# EAGLE design RAMPS-1-4-TMC (EAGLE 8.7.0)
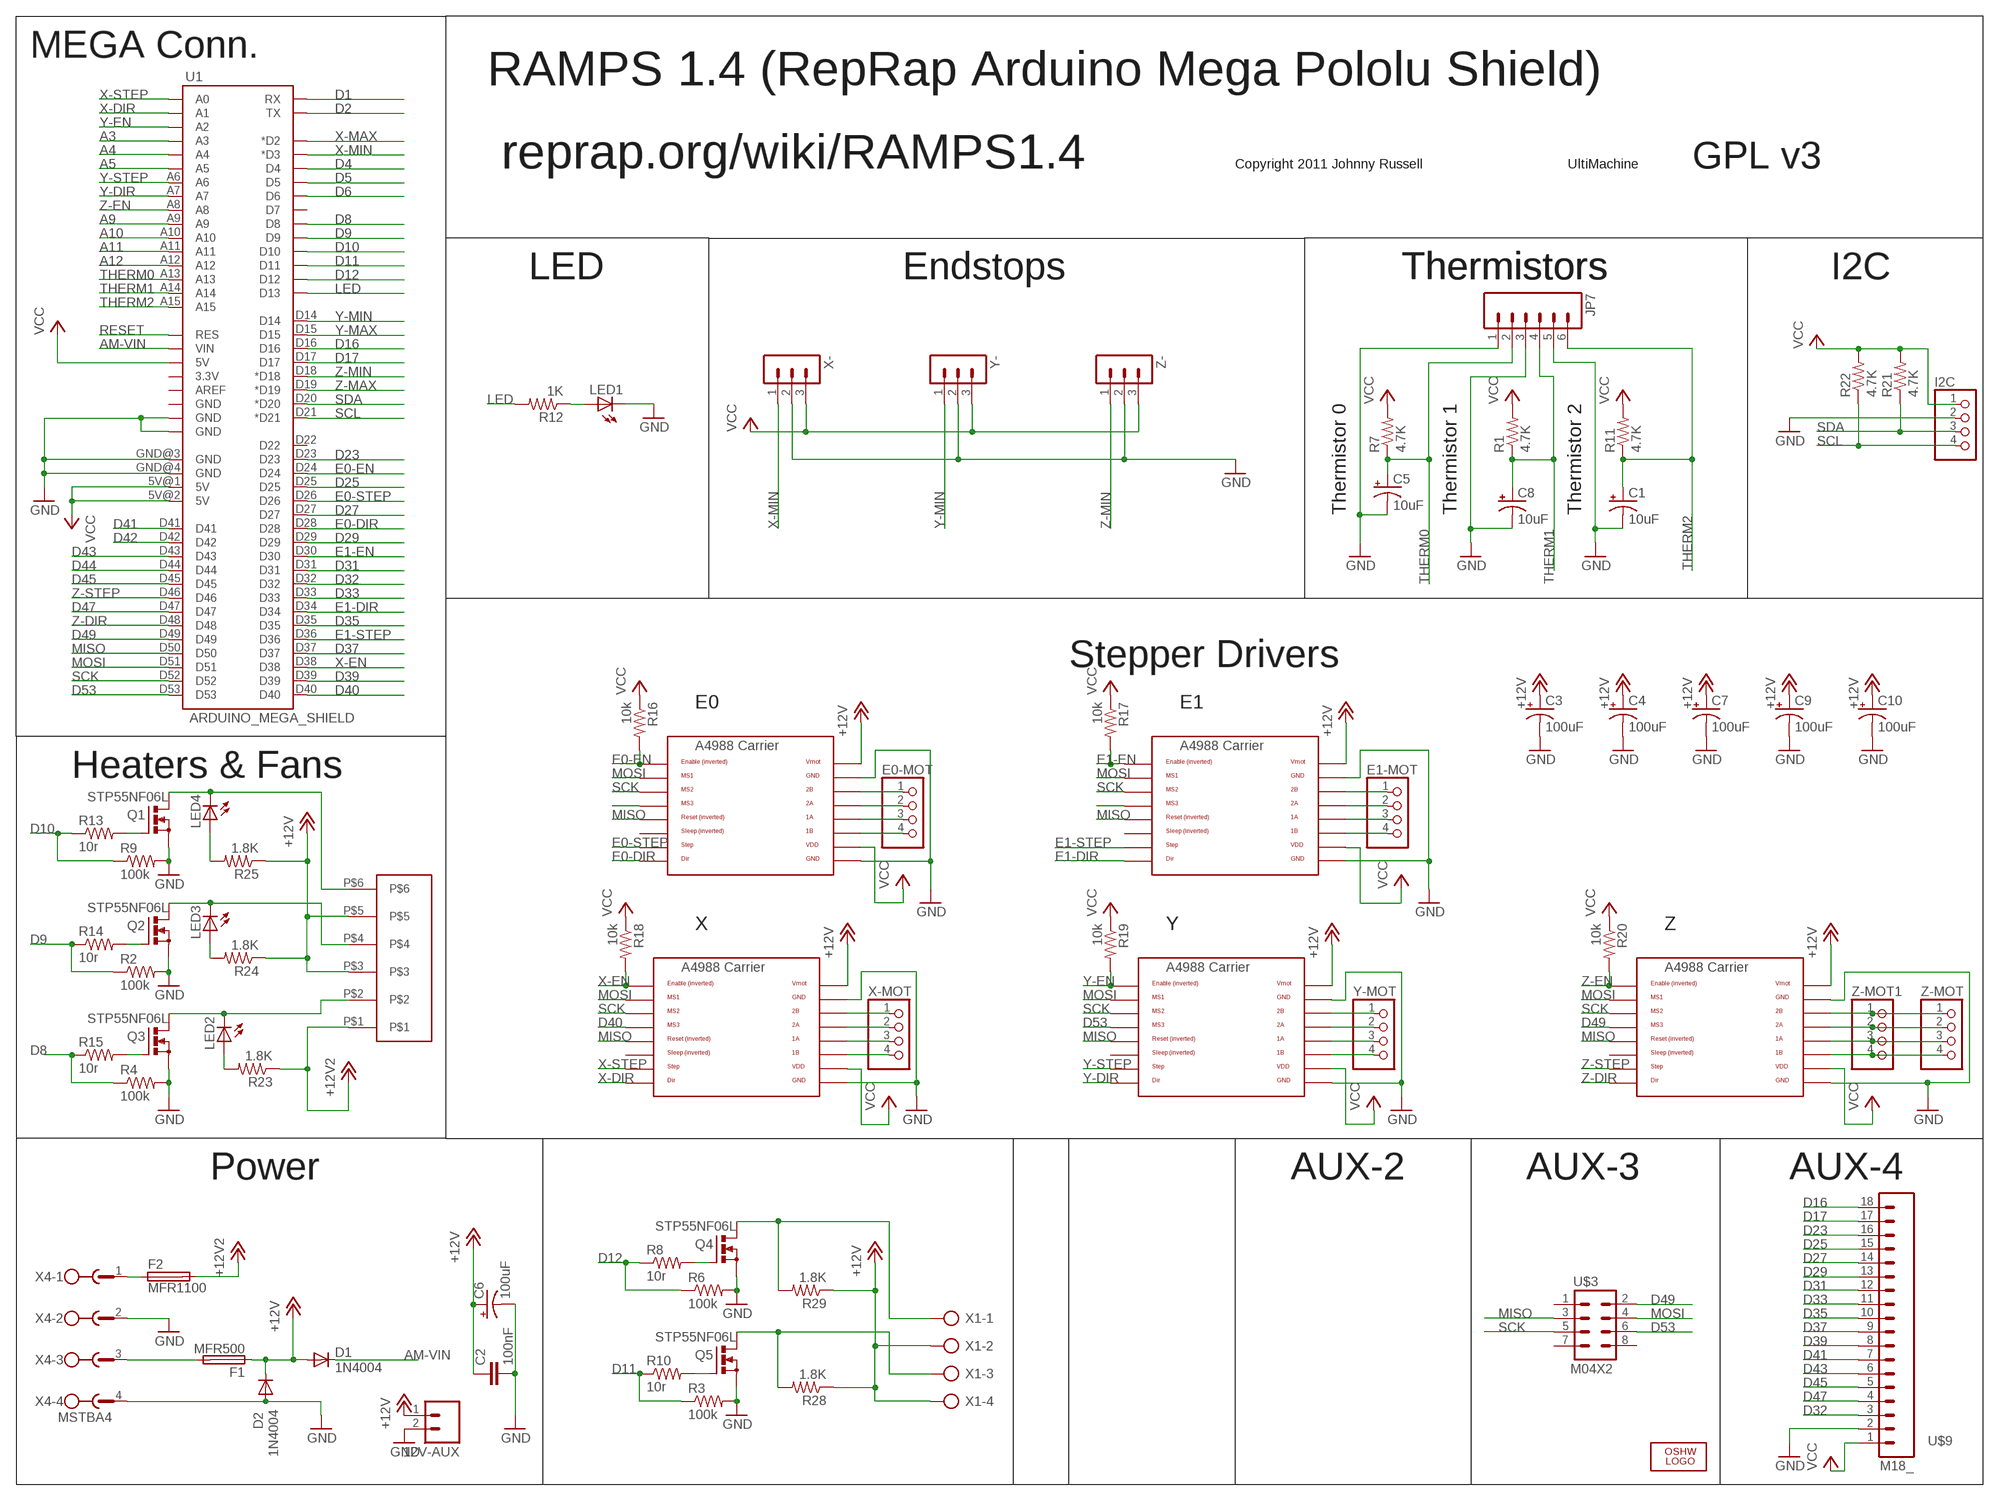
[diagram p0: schematic, sheet 1]

## Parts
12V-AUX  M02PTH  [1X02]
C1  10uF  CPOL-US153CLV-0405  [153CLV-0405]
C2  100nF  C-EUC0805  [C0805]
C3  100uF  CPOL-US153CLV-0605  [153CLV-0605]
C4  100uF  CPOL-US153CLV-0605  [153CLV-0605]
C5  10uF  CPOL-US153CLV-0405  [153CLV-0405]
C6  100uF  CPOL-US153CLV-0605  [153CLV-0605]
C7  100uF  CPOL-US153CLV-0605  [153CLV-0605]
C8  10uF  CPOL-US153CLV-0405  [153CLV-0405]
C9  100uF  CPOL-US153CLV-0605  [153CLV-0605]
C10  100uF  CPOL-US153CLV-0605  [153CLV-0605]
D1  1N4004  [DO41-10]
D2  1N4004  [DO41-10]
E0-MOT  PINHD-1X4  [1X04]
E1-MOT  PINHD-1X4  [1X04]
F1  MFR500  PTCFUSE  [MFR500]
F2  MFR1100  PTCFUSEMFR1100  [MFR1100]
I2C  PINHD-1X4  [1X04]
JP7  M06SIP  [1X06]
LED1  LEDCHIP-LED0805  [CHIP-LED0805]
LED2  LEDCHIP-LED0805  [CHIP-LED0805]
LED3  LEDCHIP-LED0805  [CHIP-LED0805]
LED4  LEDCHIP-LED0805  [CHIP-LED0805]
LOGO1  OSHW_LOGO_6MILX0100-NT  [OSHW_6X100_NOTEXT]
Q1  STP55NF06L  IRF512  [TO220BV]
Q2  STP55NF06L  IRF512  [TO220BV]
Q3  STP55NF06L  IRF512  [TO220BV]
Q4  STP55NF06L  IRF512  [TO220BV]
Q5  STP55NF06L  IRF512  [TO220BV]
R1  4.7K  R-US_R0805  [R0805]
R2  100k  R-US_R0805  [R0805]
R3  100k  R-US_R0805  [R0805]
R4  100k  R-US_R0805  [R0805]
R6  100k  R-US_R0805  [R0805]
R7  4.7K  R-US_R0805  [R0805]
R8  10r  R-US_R0805  [R0805]
R9  100k  R-US_R0805  [R0805]
R10  10r  R-US_M0805  [M0805]
R11  4.7K  R-US_R0805  [R0805]
R12  1K  R-US_R0805  [R0805]
R13  10r  R-US_R0805  [R0805]
R14  10r  R-US_M0805  [M0805]
R15  10r  R-US_R0805  [R0805]
R16  10k  R-US_R0805  [R0805]
R17  10k  R-US_R0805  [R0805]
R18  10k  R-US_R0805  [R0805]
R19  10k  R-US_R0805  [R0805]
R20  10k  R-US_R0805  [R0805]
R21  4.7K  R-US_R0805  [R0805]
R22  4.7K  R-US_R0805  [R0805]
R23  1.8K  R-US_R0805  [R0805]
R24  1.8K  R-US_R0805  [R0805]
R25  1.8K  R-US_R0805  [R0805]
R28  1.8K  R-US_R0805  [R0805]
R29  1.8K  R-US_R0805  [R0805]
U1  ARDUINO_MEGA_SHIELD  [ARDUINO_MEGA_SHIELD]
U$2  282837-6  [282837-6]
U$3  M04X2  [2X4]
U$4  A4988BREAKOUT  [A4988BREAKOUT]
U$5  A4988BREAKOUT  [A4988BREAKOUT]
U$6  A4988BREAKOUT  [A4988BREAKOUT]
U$7  A4988BREAKOUT  [A4988BREAKOUT]
U$8  A4988BREAKOUT  [A4988BREAKOUT]
U$9  M18_  [1X18]
X1  AK500/4  [AK500/4]
X4  MSTBA4  [MSTBA4]
X-  3PIN-HEADER  [3PIN-HEADER]
X-MOT  PINHD-1X4  [1X04]
Y-  3PIN-HEADER  [3PIN-HEADER]
Y-MOT  PINHD-1X4  [1X04]
Z-  3PIN-HEADER  [3PIN-HEADER]
Z-MOT  PINHD-1X4  [1X04]
Z-MOT1  PINHD-1X4  [1X04]

## Nets
+12V: 12V-AUX.1 C2.1 C3.+ C4.+ C6.+ C7.+ C9.+ C10.+ D1.A D2.C F1.1 R24.1 R25.1 R28.1 R29.1 U$2.P$3 U$2.P$5 U$4.VMOT U$5.VMOT U$6.VMOT U$7.VMOT U$8.VMOT X1.2 X1.4
+12V2: F2.2 R23.1 U$2.P$1
A3: U1.A3
A4: U1.A4
A5: U1.A5
A9: U1.A9
A10: U1.A10
A11: U1.A11
A12: U1.A12
AM-VIN: D1.C U1.VIN
D1: U1.RX
D2: U1.TX
D4: U1.D4
D5: U1.D5
D6: U1.D6
D8: R4.1 R15.1 U1.D8
D9: R2.1 R14.1 U1.D9
D10: R9.1 R13.1 U1.D10
D11: R3.1 R10.1 U1.D11
D12: R6.1 R8.1 U1.D12
D16: U1.D16 U$9.18
D17: U1.D17 U$9.17
D23: U1.D23 U$9.16
D25: U1.D25 U$9.15
D27: U1.D27 U$9.14
D29: U1.D29 U$9.13
D31: U1.D31 U$9.12
D32: U1.D32 U$9.3
D33: U1.D33 U$9.11
D35: U1.D35 U$9.10
D37: U1.D37 U$9.9
D39: U1.D39 U$9.8
D40: U1.D40 U$6.MS3
D41: U1.D41 U$9.7
D42: U1.D42
D43: U1.D43 U$9.6
D44: U1.D44
D45: U1.D45 U$9.5
D47: U1.D47 U$9.4
D49: U1.D49 U$3.2 U$8.MS3
D53: U1.D53 U$3.6 U$7.MS3
E0-DIR: U1.D28 U$4.DIR
E0-EN: R16.2 U1.D24 U$4.EN
E0-STEP: U1.D26 U$4.STEP
E1-DIR: U1.D34 U$5.DIR
E1-EN: R17.2 U1.D30 U$5.EN
E1-STEP: U1.D36 U$5.STEP
GND: 12V-AUX.2 C1.- C2.2 C3.- C4.- C5.- C6.- C7.- C8.- C9.- C10.- D2.A I2C.2 JP7.1 JP7.3 JP7.5 LED1.C Q1.S Q2.S Q3.S Q4.S Q5.S R2.2 R3.2 R4.2 R6.2 R9.2 U1.GND@0(GND) U1.GND@1(GND) U1.GND@3(GND) U1.GND@4(GND) U$4.GND U$4.GND@0(GND) U$5.GND U$5.GND@0(GND) U$6.GND U$6.GND@0(GND) U$7.GND U$7.GND@0(GND) U$8.GND U$8.GND@0(GND) U$9.2 X4.2 X4.4 X-.2 Y-.2 Z-.2
LED: R12.2 U1.D13
MISO: U1.D50 U$3.3 U$4.RST U$5.RST U$6.RST U$7.RST U$8.RST
MOSI: U1.D51 U$3.4 U$4.MS1 U$5.MS1 U$6.MS1 U$7.MS1 U$8.MS1
N$1: LED3.C Q2.D U$2.P$4
N$3: E0-MOT.1 U$4.2B
N$4: E0-MOT.2 U$4.2A
N$6: U$4.MS3
N$7: LED4.C Q1.D U$2.P$6
N$8: Q4.D R29.2 X1.1
N$9: Q5.G R10.2
N$10: E0-MOT.3 U$4.1A
N$11: E0-MOT.4 U$4.1B
N$12: E1-MOT.1 U$5.2B
N$13: E1-MOT.2 U$5.2A
N$14: Q4.G R8.2
N$15: U$5.MS3
N$16: E1-MOT.3 U$5.1A
N$18: E1-MOT.4 U$5.1B
N$20: Q5.D R28.2 X1.3
N$21: U$6.2B X-MOT.1
N$22: U$6.2A X-MOT.2
N$26: U$6.1A X-MOT.3
N$27: U$6.1B X-MOT.4
N$28: U$7.2B Y-MOT.1
N$29: U$7.2A Y-MOT.2
N$30: U$7.1A Y-MOT.3
N$32: LED2.A R23.2
N$36: U$7.1B Y-MOT.4
N$41: U$8.2B Z-MOT1.1 Z-MOT.1
N$42: U$8.2A Z-MOT1.2 Z-MOT.2
N$43: U$8.1A Z-MOT1.3 Z-MOT.3
N$44: U$8.1B Z-MOT1.4 Z-MOT.4
N$45: LED3.A R24.2
N$46: LED1.A R12.1
N$47: Q2.G R14.2
N$48: Q1.G R13.2
N$49: Q3.G R15.2
N$50: LED4.A R25.2
N$51: LED2.C Q3.D U$2.P$2
N$53: F2.1 X4.1
N$54: F1.2 X4.3
RESET: U1.RES
SCK: U1.D52 U$3.5 U$4.MS2 U$5.MS2 U$6.MS2 U$7.MS2 U$8.MS2
SCL: I2C.4 R22.1 U1.D21(*D21)
SDA: I2C.3 R21.1 U1.D20(*D20)
THERM0: C5.+ JP7.2 R7.1 U1.A13
THERM1: C8.+ JP7.4 R1.1 U1.A14
THERM2: C1.+ JP7.6 R11.1 U1.A15
VCC: I2C.1 R1.2 R7.2 R11.2 R16.1 R17.1 R18.1 R19.1 R20.1 R21.2 R22.2 U1.5V@0(5V) U1.5V@1(5V) U1.5V@2(5V) U$4.VDD U$5.VDD U$6.VDD U$7.VDD U$8.VDD U$9.1 X-.3 Y-.3 Z-.3
X-DIR: U1.A1 U$6.DIR
X-EN: R18.2 U1.D38 U$6.EN
X-MAX: U1.D2(*D2)
X-MIN: U1.D3(*D3) X-.1
X-STEP: U1.A0 U$6.STEP
Y-DIR: U1.A7 U$7.DIR
Y-EN: R19.2 U1.A2 U$7.EN
Y-MAX: U1.D15
Y-MIN: U1.D14 Y-.1
Y-STEP: U1.A6 U$7.STEP
Z-DIR: U1.D48 U$8.DIR
Z-EN: R20.2 U1.A8 U$8.EN
Z-MAX: U1.D19(*D19)
Z-MIN: U1.D18(*D18) Z-.1
Z-STEP: U1.D46 U$8.STEP
Unconnected: U1.3.3V U1.AREF U1.D7 U1.D22 U1.GND@2(GND) U$3.1 U$3.7 U$3.8 U$4.SLP(SLEEP) U$5.SLP(SLEEP) U$6.SLP(SLEEP) U$7.SLP(SLEEP) U$8.SLP(SLEEP)

## Notes on the sheet
- MEGA Conn.
- RAMPS 1.4 (RepRap Arduino Mega Pololu Shield)
- reprap.org/wiki/RAMPS1.4 | Copyright 2011 Johnny Russell | UltiMachine | GPL v3
- LED | Endstops | Thermistors | Thermistors | I2C
- Thermistor 0 | Thermistor 1 | Thermistor 2
- Stepper Drivers
- E0 | E1
- Heaters & Fans
- X | Y | Z
- Power | AUX-2 | AUX-3 | AUX-4

## Library data of the parts
12V-AUX = SparkFun:M02: Header 2 Standard 2-pin 0.1" header. Use with straight break away headers (SKU : PRT-00116), right angle break away headers (PRT-00553), swiss pins (PRT-00743), machine pins (PRT-00117), and female headers (PRT-00115). Molex polarized connector foot print use with SKU : PRT-08233 with associated crimp pins and housings.
C1 C3-C10 = adafruit:CPOL-US: POLARIZED CAPACITOR, American symbol
C2 = resistor:C-EU: CAPACITOR, European symbol
D1 D2 = diode:1N4004: DIODE general purpose rectifier, 1 A
E0-MOT E1-MOT I2C X-MOT Y-MOT Z-MOT Z-MOT1 = RepRapjr:PINHD-1X4: PIN HEADER
F1 F2 = RepRapjr:PTCFUSE: LITTLEFUSE Picofuse/slow Littlefuse
JP7 = SparkFun:M06: Header 6 Standard 6-pin 0.1" header. Use with straight break away headers (SKU : PRT-00116), right angle break away headers (PRT-00553), swiss pins (PRT-00743), machine pins (PRT-00117), and female headers (PRT-00115). Molex polarized connector foot print use with SKU : PRT-08094 with associated crimp pins and housings. NOTES ON THE VARIANTS LOCK and LOCK_LONGPADS... This footprint was designed to help hold the alignment of a through-hole component (i.e. 6-pin header) while soldering it into place. You may notice that each hole has been shifted either up or down by 0.005 of an inch from it's more standard position (which is a perfectly straight line). This slight alteration caused the pins (the squares in the middle) to touch the edges of the holes. Because they are alternating, it causes a "brace" to hold the component in place. 0.005 has proven to be the perfect amount of "off-center" position when using our standard breakaway headers. Although looks a little odd when you look at the bare footprint, once you have a header in there, the alteration is very hard to notice. Also, if you push a header all the way into place, it is covered up entirely on the bottom side. This idea of altering the position of holes to aid alignment will be further integrated into the Sparkfun Library for other footprints. It can help hold any component with 3 or more connection pins.
LED1-LED4 = led:LED: LED OSRAM: - CHIPLED LG R971, LG N971, LY N971, LG Q971, LY Q971, LO R971, LY R971 LH N974, LH R974 LS Q976, LO Q976, LY Q976 LO Q996 - Hyper CHIPLED LW Q18S LB Q993, LB Q99A, LB R99A - SideLED LS A670, LO A670, LY A670, LG A670, LP A670 LB A673, LV A673, LT A673, LW A673 LH A674 LY A675 LS A676, LA A676, LO A676, LY A676, LW A676 LS A679, LY A679, LG A679 - Hyper Micro SIDELED® LS Y876, LA Y876, LO Y876, LY Y876 LT Y87S - SmartLED LW L88C, LW L88S LB L89C, LB L89S, LG L890 LS L89K, LO L89K, LY L89K LS L896, LA L896, LO L896, LY L896 - TOPLED LS T670, LO T670, LY T670, LG T670, LP T670 LSG T670, LSP T670, LSY T670, LOP T670, LYG T670 LG T671, LOG T671, LSG T671 LB T673, LV T673, LT T673, LW T673 LH T674 LS T676, LA T676, LO T676, LY T676, LB T676, LH T676, LSB T676, LW T676 LB T67C, LV T67C, LT T67C, LS T67K, LO T67K, LY T67K, LW E67C LS E67B, LA E67B, LO E67B, LY E67B, LB E67C, LV E67C, LT E67C LW T67C LS T679, LY T679, LG T679 LS T770, LO T770, LY T770, LG T770, LP T770 LB T773, LV T773, LT T773, LW T773 LH T774 LS E675, LA E675, LY E675, LS T675 LS T776, LA T776, LO T776, LY T776, LB T776 LHGB T686 LT T68C, LB T68C - Hyper Mini TOPLED® LB M676 - Mini TOPLED Santana® LG M470 LS M47K, LO M47K, LY M47K Source: http://www.osram.convergy.de LUXEON: - LUMILED® LXK2-PW12-R00, LXK2-PW12-S00, LXK2-PW14-U00, LXK2-PW14-V00 LXK2-PM12-R00, LXK2-PM12-S00, LXK2-PM14-U00 LXK2-PE12-Q00, LXK2-PE12-R00, LXK2-PE12-S00, LXK2-PE14-T00, LXK2-PE14-U00 LXK2-PB12-K00, LXK2-PB12-L00, LXK2-PB12-M00, LXK2-PB14-N00, LXK2-PB14-P00, LXK2-PB14-Q00 LXK2-PR12-L00, LXK2-PR12-M00, LXK2-PR14-Q00, LXK2-PR14-R00 LXK2-PD12-Q00, LXK2-PD12-R00, LXK2-PD12-S00 LXK2-PH12-R00, LXK2-PH12-S00 LXK2-PL12-P00, LXK2-PL12-Q00, LXK2-PL12-R00 Source: www.luxeon.com KINGBRIGHT: KA-3528ASYC Source: www.kingbright.com
LOGO1 = OSHW:OSHW_LOGO_6MIL
Q1-Q5 = transistor-power:IRF512: N-CHANNEL MOS FET
R1-R4 R6 R7 R9 R11 R12 R16-R25 R28 R29 = adafruit:R-US_: RESISTOR, American symbol
R8 R10 R13-R15 = resistor:R-US_: RESISTOR, American symbol
U1 = RepRapjr:ARDUINO_MEGA_SHIELD
U$2 = RepRapjr:282837-6
U$3 = SparkFun:M04X2
U$4-U$8 = RepRapjr:A4988BREAKOUT
U$9 = SparkFun:M18
X1 = con-ptr500:AK500/4: CONNECTOR; OC_FARNELL: unknown; OC_NEWARK: unknown
X4 = con-phoenix-508:MSTBA4: PHOENIX
X- Y- Z- = ultimachine:3PIN-HEADER: PIN HEADER

## Board
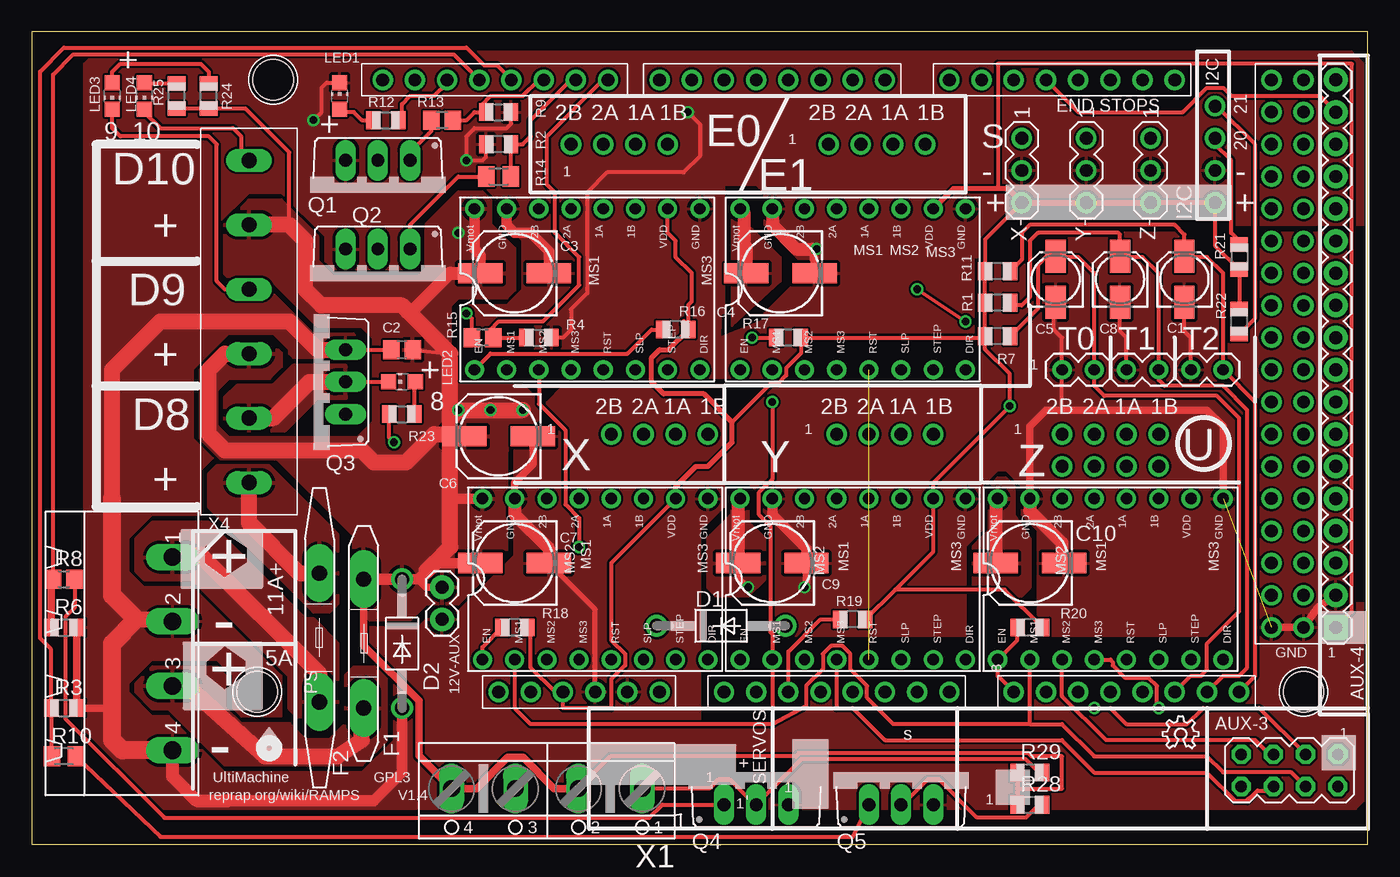
[diagram p1: board, top side]
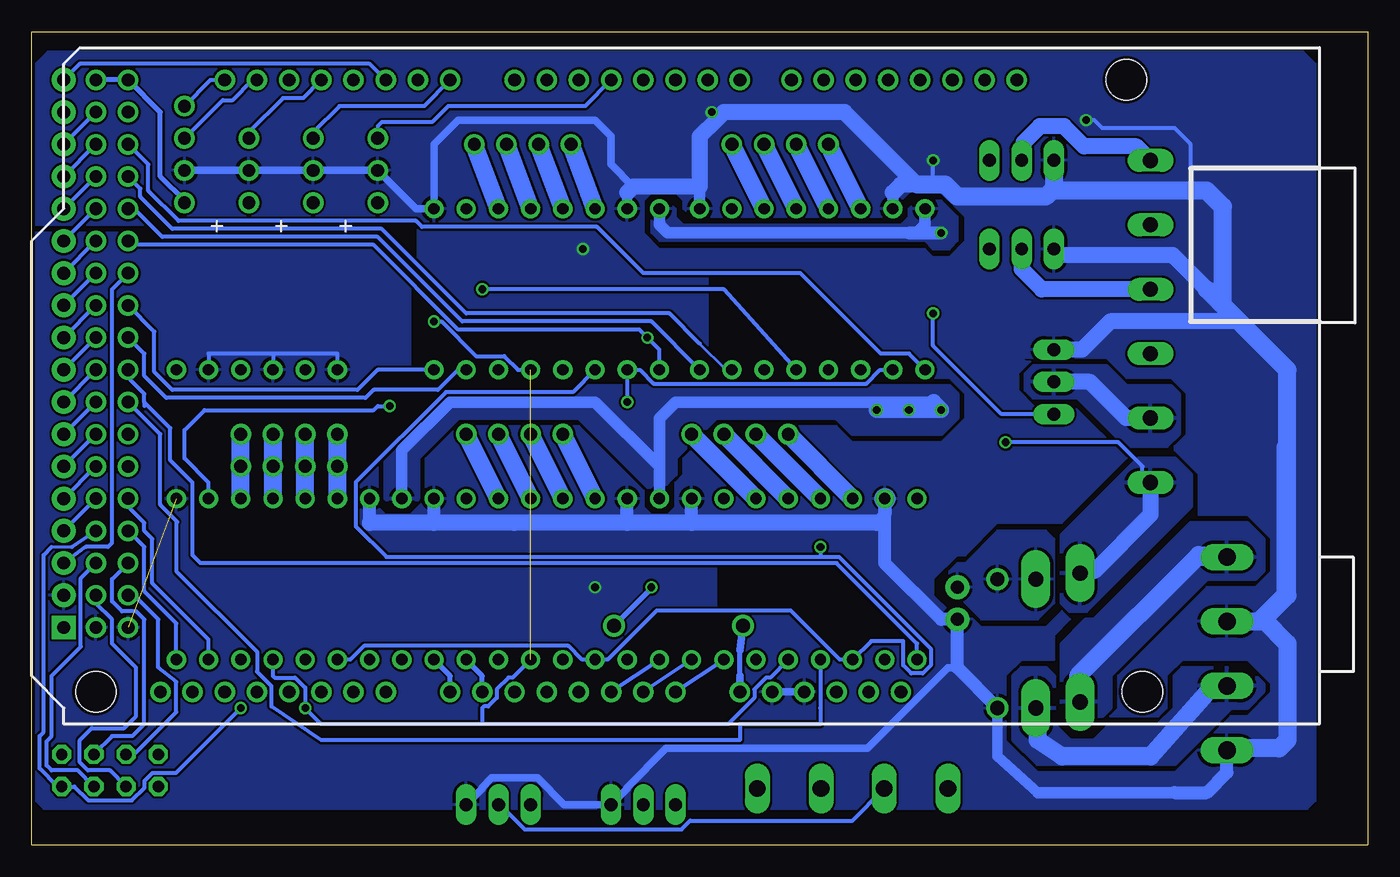
[diagram p2: board, bottom side, seen from below]

Size 105.4 x 64.12 mm. Coordinates in mm from the lower left corner, seen from the top.
Outline: 105.4,0 105.4,64.12 0,64.12 0,0 105.4,0
Copper layers (1*16): Top 0.035mm / dielectric 1.5mm / Bottom 0.035mm
Design rules "GoldPhoenix": minimum track width 7mil, minimum drill 15mil, track to track 7mil, track to pad 7mil, pad to pad 7mil, via to via 7mil, smd to smd 7mil, copper to edge 10mil, drill to drill 8mil, minimum pad ring 12mil, minimum via ring 7mil, stop-mask expansion 4mil, vias tented up to drill 25mil, thermal gap 10mil

### Footprints (pad centres in the part's own frame; a part is rotated, then mirrored left to right if it is on the bottom)
1X02 = drill 1.016 pad 1.88: 1 0,0; 2 2.54,0
153CLV-0405 = smd 2.6 x 1.6: + 1.8,0; - -1.8,0
C0805 = smd 1.3 x 1.5: 1 -0.85,0; 2 0.85,0
153CLV-0605 = smd 3.5 x 1.6: + 2.7,0; - -2.7,0
DO41-10 = drill 1.118: A 5.08,0; C -5.08,0
1X04 = drill 1.016: 1 -2.54,0; 2 0,0; 3 2.54,0; 4 5.08,0
MFR500 = drill 1.2 pad 2.3 long: 1 -5.08,0; 2 5.08,0
MFR1100 = drill 1.2 pad 2.3 long: 1 -5.08,0; 2 5.08,0
1X06 = drill 0.9 pad 1.422: 1 0,0; 2 2.54,0; 3 5.08,0; 4 7.62,0; 5 10.16,0; 6 12.7,0
CHIP-LED0805 = smd 1.2 x 1.2: A 0,-1.05; C 0,1.05
TO220BV = drill 1.016 long: D 0,-2.54; G -2.54,-2.54; S 2.54,-2.54
R0805 = smd 1.1 x 1.4: 1 -1,0; 2 1,0
R0805' = smd 1.3 x 1.5: 1 -0.85,0; 2 0.85,0
M0805 = smd 1.3 x 1.6: 1 -0.95,0; 2 0.95,0
ARDUINO_MEGA_SHIELD = drill 1 pad 1.422: 3.3V 35.56,2.54; 5V@0 38.1,2.54; 5V@1 93.98,50.8; 5V@2 96.52,50.8; A0 50.8,2.54; A1 53.34,2.54; A2 55.88,2.54; A3 58.42,2.54; A4 60.96,2.54; A5 63.5,2.54; A6 66.04,2.54; A7 68.58,2.54; A8 73.66,2.54; A9 76.2,2.54; A10 78.74,2.54; A11 81.28,2.54; A12 83.82,2.54; A13 86.36,2.54; A14 88.9,2.54; A15 91.44,2.54; AREF 23.876,50.8; D2 58.42,50.8; D3 55.88,50.8; D4 53.34,50.8; D5 50.8,50.8; D6 48.26,50.8; D7 45.72,50.8; D8 41.656,50.8; D9 39.116,50.8; D10 36.576,50.8; D11 34.036,50.8; D12 31.496,50.8; D13 28.956,50.8; D14 68.58,50.8; D15 71.12,50.8; D16 73.66,50.8; D17 76.2,50.8; D18 78.74,50.8; D19 81.28,50.8; D20 83.82,50.8; D21 86.36,50.8; D22 93.98,48.26; D23 96.52,48.26; D24 93.98,45.72; D25 96.52,45.72; D26 93.98,43.18; D27 96.52,43.18; D28 93.98,40.64; D29 96.52,40.64; D30 93.98,38.1; D31 96.52,38.1; D32 93.98,35.56; D33 96.52,35.56; D34 93.98,33.02; D35 96.52,33.02; D36 93.98,30.48; D37 96.52,30.48; D38 93.98,27.94; D39 96.52,27.94; D40 93.98,25.4; D41 96.52,25.4; D42 93.98,22.86; D43 96.52,22.86; D44 93.98,20.32; D45 96.52,20.32; D46 93.98,17.78; D47 96.52,17.78; D48 93.98,15.24; D49 96.52,15.24; D50 93.98,12.7; D51 96.52,12.7; D52 93.98,10.16; D53 96.52,10.16; GND@0 40.64,2.54; GND@1 43.18,2.54; GND@2 26.416,50.8; GND@3 93.98,7.62; GND@4 96.52,7.62; RES 33.02,2.54; RX 63.5,50.8; TX 60.96,50.8; VIN 45.72,2.54 | hole 3.2: 96.52,2.54; 13.97,2.54; 15.24,50.8
282837-6 = drill 1.2 long: P$1 0,-12.7; P$2 0,-7.62; P$3 0,-2.54; P$4 0,2.54; P$5 0,7.62; P$6 0,12.7
2X4 = drill 0.9 pad 1.422 octagon: 1 -3.81,-1.27; 2 -3.81,1.27; 3 -1.27,-1.27; 4 -1.27,1.27; 5 1.27,-1.27; 6 1.27,1.27; 7 3.81,-1.27; 8 3.81,1.27
A4988BREAKOUT = drill 0.9: 1A 8.89,1.27; 1B 11.43,1.27; 2A 6.35,1.27; 2B 3.81,1.27; DIR 16.51,-11.43; EN -1.27,-11.43; GND 16.51,1.27; GND@0 1.27,1.27; MS1 1.27,-11.43; MS2 3.81,-11.43; MS3 6.35,-11.43; RST 8.89,-11.43; SLP 11.43,-11.43; STEP 13.97,-11.43; VDD 13.97,1.27; VMOT -1.27,1.27
1X18 = drill 1.016 pad 1.88 square: 1 0,0 | drill 1.016 pad 1.88: 2 2.54,0; 3 5.08,0; 4 7.62,0; 5 10.16,0; 6 12.7,0; 7 15.24,0; 8 17.78,0; 9 20.32,0; 10 22.86,0; 11 25.4,0; 12 27.94,0; 13 30.48,0; 14 33.02,0; 15 35.56,0; 16 38.1,0; 17 40.64,0; 18 43.18,0
AK500/4 = drill 1.321 long: 1 -7.518,0; 2 -2.489,0; 3 2.489,0; 4 7.518,0
MSTBA4 = drill 1.397 long: 1 -7.62,5.08; 2 -2.54,5.08; 3 2.54,5.08; 4 7.62,5.08
3PIN-HEADER = drill 1.016: 1 -2.54,0; 2 0,0; 3 2.54,0

### Placement (x,y rotation side)
12V-AUX  32.38,20.32 270 top
C1  90.93,44.6 90 top
C2  29.21,39.05 180 top
C3  38.1,45.08 180 top
C4  59.05,45.08 180 top
C5  80.77,44.6 90 top
C6  36.83,32.23 180 top
C7  38.1,22.23 180 top
C8  85.85,44.6 90 top
C9  58.42,22.23 180 top
C10  78.74,22.23 180 top
D1  54.38,17.27 0 top
D2  29.21,15.88 270 top
E0-MOT  45.08,55.25 0 top
E1-MOT  65.41,55.25 0 top
F1  26.19,15.88 270 top
F2  22.7,16.35 90 top
I2C  93.34,53.18 90 top
JP7  81.28,37.47 0 top
LED1  24.29,59.05 0 top
LED2  29.21,36.51 90 top
LED3  6.35,59.05 180 top
LED4  8.89,59.05 180 top
LOGO1  89.22,7.62 0 top
Q1  27.3,51.44 180 top
Q2  27.3,44.45 180 top
Q3  22.23,36.51 90 top
Q4  57.15,5.71 0 top
Q5  68.58,5.71 0 top
R1  76.2,42.76 180 top
R2  36.83,55.25 180 top
R3  2.54,10.8 0 top
R4  40.01,40 0 top
R6  2.54,17.14 0 top
R7  76.2,40.12 180 top
R8  10r  [R0805']  2.54,20.96 0 top
R9  36.83,57.78 0 top
R10  2.54,6.98 0 top
R11  76.2,45.24 180 top
R12  27.94,57.15 0 top
R13  10r  [R0805']  32.38,57.15 180 top
R14  36.83,52.7 180 top
R15  10r  [R0805']  35.56,40 180 top
R16  50.8,40.64 180 top
R17  59.69,40 180 top
R18  38.1,17.14 180 top
R19  64.77,17.78 180 top
R20  78.74,17.14 180 top
R21  95.25,46.36 270 top
R22  95.25,41.28 90 top
R23  29.21,33.97 0 top
R24  13.97,59.05 90 top
R25  11.43,59.05 90 top
R28  78.74,3.18 0 top
R29  78.74,5.71 0 top
U1  3.81,9.53 0 top
U$2  17.14,41.28 0 top
U$3  99.22,5.87 180 top
U$4  36.2,48.89 0 top
U$5  57.15,48.89 0 top
U$6  36.83,26.04 0 top
U$7  57.15,26.04 0 top
U$8  77.47,26.04 0 top
U$9  102.87,17.14 90 top
X1  40.64,4.45 180 top
X4  6.03,15.08 270 top
X-  78.11,53.18 270 top
X-MOT  48.26,32.38 0 top
Y-  83.19,53.18 270 top
Y-MOT  66.04,32.38 0 top
Z-  88.27,53.18 270 top
Z-MOT  83.82,32.39 0 top
Z-MOT1  83.82,29.85 0 top

### Tracks (layer width: path | path; a pad name or v marks a point on that pad's centre or on a via)
+12V  (via drill 0.6)
  Top 0.305: R25.1 R24.1 16.88,58.06 20.32,54.61 20.32,48.89 | R29.1 77.74,4.45 | 77.74,4.45 R28.1 | 77.74,4.45 81.28,4.45 81.28,6.98 78.87,6.98 78.63,7.23 60.52,7.23 60.28,6.98 45.67,6.98 X1.2 | C2.1 33.02,38.73 | C6.+ 33.02,33.66
  Top 0.406: C9.+ 55.72,21.11 v56.52,20.32
  Top 0.61: 12V-AUX.1 31.11,20.32 30.48,20.96 | F1.1 26.19,15.71 30.56,11.35 30.56,7.01 X1.4 35.08,4.45 37.54,6.91 38.76,6.91 41.23,4.45 X1.2
  Top 0.813: D2.C 30.48,20.96 31.11,21.59 | 31.75,22.23 C7.+ | U$6.VMOT | C3.+ 35.4,46.52 34.92,46.99 U$4.VMOT | 33.02,27.31 U$6.VMOT | 33.02,27.31
  Top 0.914: F1.1 D2.C
  Top 1.016: C9.+ 55.72,27.14 U$7.VMOT | C10.+ 76.04,27.14 U$8.VMOT | C4.+ 56.36,47.15 56.2,47.31 56.2,49.85 U$5.VMOT | C3.+ 33.02,45.08 30,42.07 29.69,42.07
  Top 1.27: 31.11,21.59 31.75,22.23 33.02,23.5 33.02,27.31 33.02,33.66 | U$2.P$5 20.32,48.89 21.59,47.62 21.59,43.81 22.86,42.55 29.21,42.55 29.69,42.07 33.02,38.73 33.02,33.66 | 33.02,33.66 v33.66,34.29 v36.2,34.29 v38.73,34.29 | C6.+ 33.97,32.39 31.75,32.39 29.53,30.16 26.99,30.16 26.04,31.11 15.24,31.11 13.97,32.39 13.97,37.47 15.24,38.73 U$2.P$3
  Bottom 0.406: v56.52,20.32 56.52,20.22 D1.A
  Bottom 0.914: U$4.VMOT 34.92,48.89 35.56,48.26 36.2,48.26 55.25,48.26 55.88,48.89 U$5.VMOT | U$8.VMOT 76.2,31.11 72.39,34.92 60.96,34.92 55.88,29.85 | 55.88,29.85 U$7.VMOT | 55.88,29.85 55.88,33.66 54.61,34.92 34.26,34.92
  Bottom 1.016: 36.2,48.26 v33.66,48.26
  Bottom 1.27: 34.26,34.92 34.26,34.89 v33.66,34.29 v38.73,34.29 | U$6.VMOT
  pour Top: 25.4,24.45 25.4,19.05 26.67,17.78 29.84,17.78 31.11,19.05 33.66,19.05 37.47,22.86 37.47,31.11 40.01,33.66 40.01,34.92 38.73,36.19 33.66,36.19 33.02,36.83 33.02,42.55 33.66,43.18 37.47,43.18 38.1,43.81 38.1,46.99 36.2,48.89 36.2,50.8 35.56,51.44 33.66,51.44 31.11,48.89 31.11,45.4 30.48,44.77 23.81,44.77 22.54,46.04 22.54,47.94 19.68,50.8 17.14,50.8 15.24,48.89 15.24,45.08 15.88,44.45 19.05,44.45 22.54,40.96 26.04,40.96 26.99,40 26.99,33.34 25.72,32.07 15.56,32.07 14.61,33.02 14.61,35.88 15.56,36.83 18.73,36.83 19.68,37.78 19.68,38.73 19.05,39.37 15.24,39.37 13.34,37.47 13.34,32.07 14.92,30.48 19.37,30.48
  pour Bottom: 32.38,35.56 32.38,33.66 33.66,32.39 40.64,32.39 41.91,33.66 51.44,33.66 54.61,30.48 54.61,29.21 55.88,27.94 56.52,27.94 62.23,33.66 71.75,33.66 74.93,30.48 74.93,27.31 75.56,26.67 76.84,26.67 77.47,27.31 77.47,31.11 73.66,34.92 73.03,34.92 71.75,36.19 33.02,36.19
  pour Top: 55.25,26.67 55.25,26.04 53.34,24.13 53.34,20.32 53.98,19.68 56.52,19.68 57.79,20.96 57.79,24.13 56.52,25.4 56.52,26.67 55.88,27.31
  pour Top: 75.56,28.26 75.56,24.77 74.3,23.5 74.3,20.32 74.93,19.68 78.11,19.68 78.74,20.32 78.74,24.13 77.47,26.04 77.47,28.26 76.84,28.89 76.2,28.89
  pour Top: 55.25,50.8 55.25,40.96 59.05,44.45 59.05,46.36 56.52,48.89 56.52,50.17 55.88,50.8
  pour Bottom: 32.38,48.89 32.38,49.53 33.66,50.8 35.56,50.8 36.2,50.17 36.2,49.53 36.83,48.89 53.98,48.89 54.61,49.53 54.61,50.17 55.25,50.8 55.88,50.8 56.52,50.17 56.52,48.26 55.88,47.62 34.92,47.62 34.29,46.99 33.02,46.99 32.38,47.62
  pour Bottom: 24.76,24.13 24.76,19.05 26.04,17.78 30.48,17.78 33.02,20.32 33.02,21.59 32.38,22.23 31.75,22.23 29.21,24.77 25.4,24.77
+12V2  (via drill 0.6)
  Top 0.305: F2.2 22.86,21.59 | R23.1 28.21,32.11 v28.57,31.75
  Top 1.27: U$2.P$1 17.14,25.4 21.11,21.43 F2.2
  Bottom 0.305: v28.57,31.75 19.68,31.75 17.78,29.85 17.78,29.21 U$2.P$1
  Bottom 1.27: U$2.P$1 17.14,26.04 21.59,21.59 22.86,21.59
  pour Top: 13.97,29.21 13.97,26.67 22.22,18.41 23.49,18.41 24.13,19.05 24.13,24.45 18.73,29.85 14.61,29.85
  pour Bottom: 13.97,29.21 13.97,26.67 22.22,18.41 23.49,18.41 24.13,19.05 24.13,24.45 18.1,30.48 15.24,30.48
AM-VIN
  Bottom 0.406: 49.53,13.34 49.53,15.35
  Bottom 0.61: 49.53,15.35 D1.C | U1.VIN 49.53,13.34
D8
  Top 0.305: U1.D8 45.09,60.33 40.64,55.88 40.64,52.07 41.28,51.44 41.28,48.26 43.18,46.36 43.18,44.13 40.32,41.28 36.83,41.28 36.2,40.64 36.2,40.22 R15.1 R4.1
D9
  Top 0.305: U1.D9 42.55,60.33 39.37,57.15 39.37,55.88 38.73,55.25 R2.1 37.83,52.75 R14.1
D10
  Top 0.305: U1.D10 40.01,60.33 38.73,59.05 36.2,59.05 35.56,58.42 35.56,58.06 R9.1 34.92,57.78 34.29,57.15 R13.1
D11
  Top 0.305: R10.1 1.54,7.04 R3.1 1.54,15.43 0.66,16.31 0.66,60.98 2.54,62.86 34.29,62.86 35.7,61.46 36.71,61.46 U1.D11
D12
  Top 0.305: R8.1 1.69,60.74 3.28,62.33 33.3,62.33 U1.D12
  Top 0.61: R8.1 1.54,20.8 R6.1
D16
  Bottom 0.305: U$9.18 101.6,61.59 78.74,61.59 U1.D16 | U$9.18
D17
  Top 0.305: U$9.17 101.6,59.05 94.62,59.05 93.98,59.69 92.71,59.69 90.81,57.78 82.55,57.78 U1.D17 | U$9.17
D23
  Bottom 0.305: U$9.16 U1.D23 | U$9.16
D25
  Bottom 0.305: U$9.15 U1.D25 | U$9.15
D27
  Bottom 0.305: U$9.14 U1.D27 | U$9.14
D29
  Bottom 0.305: U$9.13 U1.D29 | U$9.13
D31
  Bottom 0.305: U$9.12 U1.D31 | U$9.12
D32
  Bottom 0.305: U1.D32 99.06,43.81 99.06,23.81 99.38,23.5 101.12,23.5 U$9.3
D33
  Bottom 0.305: U$9.11 U1.D33 | U$9.11
D35
  Bottom 0.305: U$9.10 U1.D35 | U$9.10
D37
  Bottom 0.305: U$9.9 U1.D37 | U$9.9
D39
  Bottom 0.305: U$9.8 U1.D39
D40
  Bottom 0.305: U1.D40 95.25,32.39 95.25,26.83 93.9,25.48 93.98,25.4 93.98,21.59 87.63,15.24 87.63,13.67 86.5,12.54 86.5,10.93 82.55,8.26 49.53,8.26 49.53,9.53 43.18,9.53 43.18,10.8 | U$6.MS3 43.18,10.8 | 43.18,10.8
D41
  Bottom 0.305: U$9.7 U1.D41 | U$9.7
D43
  Bottom 0.305: U$9.6 U1.D43 | U$9.6
D45
  Bottom 0.305: U$9.5 U1.D45 | U$9.5
D47
  Bottom 0.305: U$9.4 U1.D47 | U$9.4
D49  (via drill 0.6)
  Top 0.305: U$8.MS3 85.09,14.61 85.28,14.42 85.28,14.16 86.23,13.2 88.1,13.2 88.77,12.54 88.77,10.93 v88.9,10.8
  Bottom 0.254: 103.82,23.5 102.23,23.5
  Bottom 0.305: 103.82,23.5 104.46,22.86 104.46,8.89 104.78,8.57 104.78,6.03 103.35,4.6 U$3.2 102.02,4.6 100.94,3.52 97.5,3.52 96.49,4.52 96.49,5.05 95.86,5.69 94.01,5.69 v88.9,10.8 | 102.23,23.5 U1.D49
D53
  Top 0.305: U$7.MS3 63.5,10.8 64.77,10.8 67.31,8.26 81.28,8.26 81.28,8.25 83.82,5.71 92.7,5.71 94.94,3.47 95.88,3.47 | 96.05,3.64 96.69,4.28 97.62,4.28 U$3.6
  Top 0.406: 95.88,3.47 96.05,3.64
  Bottom 0.305: U1.D53 100.33,19.05 99.06,17.78 99.06,15.88 97.16,13.97 97.16,10.16 98.11,9.21 100.65,9.21 101.6,8.26 101.6,6.5 100.97,5.87 99.21,5.87 U$3.6
E0-DIR
  Bottom 0.305: U1.D28 97.31,50.17 95.09,47.94 78.11,47.94 71.44,41.28 56.52,41.28 U$4.DIR
E0-EN
  Top 0.305: R16.2 48.9,40.64 46.99,38.73 36.2,38.73 U$4.EN
  Bottom 0.305: U1.D24 96.2,53.66 96.2,51.59 93.82,49.21 75.09,49.21 74.61,48.74 60.8,48.74 57.15,45.08 44.77,45.08 38.42,38.73 36.2,38.73 U$4.EN
E0-STEP
  Bottom 0.254: 52.71,39.53 50.64,37.47 U$4.STEP
  Bottom 0.305: U1.D26 96.84,51.75 96.84,51.12 94.3,48.58 77.79,48.58 71.12,41.91 55.09,41.91 52.71,39.53
E1-DIR
  Bottom 0.305: U1.D34 95.73,40.48 95.73,37.31 94.3,35.88 79.69,35.88 79.06,36.51 78.11,37.47 U$5.DIR
E1-EN  (via drill 0.6)
  Top 0.305: v56.83,40 R17.2
  Bottom 0.305: U1.D30 97.47,47.31 78.42,47.31 71.75,40.64 57.47,40.64 v56.83,40 55.88,39.05 U$5.EN
E1-STEP
  Bottom 0.305: U1.D36 96.52,38.73 96.52,36.99 94.77,35.24 79.06,35.24 78.42,35.88 73.34,35.88 71.75,37.47 U$5.STEP
GND  (via drill 0.6)  (1 unrouted)
  Top 0.305: R9.2 37.83,56.88 37.47,56.52 34.92,56.52 34.29,55.88 v34.29,53.97 35.56,53.97 35.83,54.25 R2.2 | C3.- 41.01,44.88 | R4.2 41.91,40 42.55,40.64 42.55,42.23 43.82,43.5 43.82,51.44 45.4,53.02 51.44,53.02 52.71,54.29 52.71,56.83 v51.75,57.78 | LED1.C 23.27,60.1 22.86,59.69 22.86,57.78 v22.22,57.15 | C5.- 80.64,42.67 80.64,40.64 81.28,40 JP7.1 81.28,34.29 | C8.- 85.85,40.51 86.36,40 JP7.3 | C1.- 90.93,40.51 91.44,40 JP7.5 | Q3.S C2.2
  Top 0.406: U1.GND@0 44.45,18.57 C7.-
  Top 0.61: U1.GND@3 U1.GND@4 101.44,18.73 U$9.2 | U$8.GND 93.98,33.02 92.71,34.29 81.28,34.29 80.01,34.29 78.74,33.02 U$8.GND@0 | U$9.2 | 61.59,46.99 61.76,45.56 C4.- 61.76,46.83 v61.91,46.99 | v60.96,20.32 61.12,20.48 C9.- | C6.- 39.53,30 38.1,28.57 U$6.GND@0 | U$6.GND@0 | R6.2 R3.2 6.35,10.8
  Top 0.813: C3.- 40.8,46.83 39.37,48.26 38.1,48.26 37.47,48.89 U$4.GND@0 | C9.- 61.12,23.34 58.42,26.04 U$7.GND@0 | 26.99,3.49 29.21,5.71 D2.A
  Top 0.914: 15.56,3.49 26.99,3.49
  Top 1.016: C7.- 40.8,23.34 38.1,26.04 U$6.GND@0 | U$8.GND@0 78.74,26.35 81.28,23.81 81.28,22.39 C10.- | U$5.GND@0 58.42,48.89 60.33,46.99 61.59,46.99 | 15.56,3.49 13.02,3.49 11.11,5.4 11.11,7.62
  Top 1.27: 8.26,17.78 10.95,17.78 | Q3.S 22.54,39.05 20.32,41.28 10.16,41.28 6.35,37.47 6.35,27.31
  Top 1.422: 6.35,27.31 6.35,19.68 8.26,17.78 6.35,15.88 6.35,10.8 6.35,8.26 7.14,7.46 X4.4 | 10.95,17.78 X4.2
  Bottom 0.305: 34.29,52.07 v34.29,53.97 | v22.22,57.15 21.59,57.15 20.95,56.52 15.24,56.52 13.97,55.25 13.97,51.59 | 81.28,37.78 JP7.1 81.28,38.73 86.36,38.73 | 86.36,38.73 JP7.3 | 86.36,38.73 91.44,38.73 JP7.5 | v51.75,57.78 51.75,57.47 51.44,57.15 | Q1.S 24.79,53.94
  Bottom 0.61: U1.GND@0 U1.GND@1 | 57.94,51.91 59.69,53.66 59.69,55.88 60.96,57.15 71.75,57.15 73.66,55.25 U$5.GND 75.09,50.17 X-.2 Y-.2 Z-.2 | Z-.2 | I2C.2 Z-.2 | Q5.S 69.88,4.42 69.88,4.52 69.12,5.28 65.5,5.28 63.4,3.18 Q4.S 58.45,4.42 58.45,4.52 55.35,7.62 39.45,7.62 33.1,13.97 32.38,13.97
  Bottom 0.813: 24.29,46.51 24.13,46.36 | 58.42,51.44 U$5.GND@0 | 26.04,4.13 29.21,6.98 D2.A
  Bottom 0.914: 26.04,4.13 15.24,4.13 | 11.43,7.62 11.27,7.62 X4.4 | 37.47,51.44 U$4.GND@0 | 52.71,51.91 U$4.GND | 24.61,51.59 25.24,51.59 | U$6.GND@0
  Bottom 1.016: 78.74,25.4 U$8.GND@0 | 73.66,25.4 U$7.GND | 58.42,25.4 U$7.GND@0 | U$6.GND | 53.34,25.4 U$6.GND | 38.73,25.4 38.1,26.04 U$6.GND@0 38.1,22.23 33.66,17.78 12V-AUX.2 32.38,13.97 D2.A | 6.67,31.43 6.67,19.84 8.89,17.62 | 15.24,4.13 12.7,4.13 11.11,5.71 X4.4
  Bottom 1.27: 12.7,43.81 15.4,46.51 24.29,46.51 Q2.S | 38.73,25.4 53.34,25.4 58.42,25.4 67.31,25.4 73.66,25.4 78.74,25.4 | 37.47,51.44 36.83,52.07 35.56,52.07 41.28,57.78 50.8,57.78 51.44,57.15 52.71,55.88 52.71,51.91 57.94,51.91 58.42,51.44 | 10.16,41.28 20.32,41.28 22.54,39.05 Q3.S | 24.79,53.94 24.79,51.81
  Bottom 1.422: 35.56,52.07 34.29,52.07 33.34,52.07 32.38,51.12 25.4,51.12 24.92,51.59 24.61,51.59 | 11.43,42.55 10.16,41.28 6.35,37.47 6.35,19.68 8.26,17.78 | 11.43,42.55 12.7,43.81 | 8.26,17.78 8.41,17.62 8.89,17.62 X4.2 | 10.79,7.62 6.98,7.62 6.35,8.26 6.35,15.88 8.26,17.78 | 24.61,51.59 13.97,51.59 12.7,51.59 11.43,50.32 11.43,42.55 | Q1.S 24.76,51.75 24.61,51.59
  Bottom 1.676: U$6.GND@0
  pour Bottom: 4.13,3.49 4.13,61.59 5.08,62.55 48.26,62.55 48.26,49.53 37.47,49.53 36.83,50.8 35.56,52.07 34.29,52.07 31.75,49.53 31.75,38.42 20.64,38.42 19.05,36.83 15.56,36.83 14.29,35.56 14.29,32.39 15.24,31.43 15.24,31.11 13.34,29.21 13.34,26.04 9.53,26.04 7.62,24.13 7.62,21.59 8.89,20.32 12.7,20.32 19.68,13.34 19.68,10.8 20.32,10.16 16.51,10.16 15.88,10.8 15.88,13.34 14.61,14.61 9.53,14.61 7.62,12.7 7.62,12.07 9.53,10.16 10.79,10.16 15.24,5.71 26.04,5.71 26.04,2.86 4.76,2.86
  pour Bottom: 22.86,2.86 22.54,5.4 26.04,5.71 28.57,8.26 28.57,13.34 27.3,14.61 24.76,14.61 24.76,16.51 23.49,17.78 24.13,18.41 25.4,17.14 30.48,17.14 31.75,18.41 33.02,18.41 34.29,19.68 34.29,20.96 32.38,22.86 31.75,22.86 29.21,25.4 24.13,25.4 19.05,30.48 23.18,34.61 26.35,34.61 27.62,35.88 27.62,37.15 26.67,38.1 26.99,38.1 27.62,38.73 29.84,47.62 31.75,47.62 33.02,46.36 34.29,46.36 34.92,46.99 53.98,46.99 53.98,36.83 33.02,36.83 31.75,35.56 31.75,33.66 33.66,31.75 40.64,31.75 41.91,33.02 51.44,33.02 53.98,30.48 53.98,29.21 54.61,28.57 54.61,2.86
  pour Bottom: 43.82,62.55 104.14,62.55 105.09,61.59 105.09,48.89 74.93,48.89 74.93,35.56 73.03,35.56 71.75,36.83 52.07,36.83 52.07,46.99 55.88,46.99 57.15,48.26 57.15,50.8 56.52,51.44 54.61,51.44 53.98,50.8 53.98,50.17 53.34,49.53 43.82,49.53
  pour Bottom: 51.44,2.86 51.44,29.85 53.98,29.85 53.98,29.21 54.61,28.57 54.61,26.67 55.25,26.04 56.52,26.04 57.15,26.67 57.15,27.94 62.23,33.02 71.75,33.02 74.3,30.48 74.3,27.31 75.56,26.04 77.47,26.04 78.11,26.67 78.11,31.11 75.56,33.66 75.56,45.72 76.2,46.36 77.47,46.36 78.11,46.99 95.25,46.99 96.52,48.26 105.09,48.26 105.09,3.49 104.46,2.86
  pour Top: 4.13,3.49 4.13,61.59 5.08,62.55 104.14,62.55 105.09,61.59 105.09,48.89 91.44,48.89 90.81,49.53 78.74,49.53 77.47,48.26 77.47,46.36 74.3,46.36 74.3,41.91 57.79,41.91 60.01,44.13 60.64,44.13 60.96,44.45 60.96,45.72 57.79,48.89 57.79,51.44 57.15,52.07 54.61,52.07 54.61,41.91 46.99,41.91 40.64,35.56 40.01,35.56 38.73,36.83 34.29,36.83 33.66,37.47 33.66,41.91 34.29,42.55 37.47,42.55 38.73,43.81 38.73,47.62 36.83,49.53 36.83,50.8 35.56,52.07 33.66,52.07 30.48,48.89 30.48,45.72 30.16,45.4 23.81,45.4 23.18,46.04 23.18,47.94 19.68,51.44 17.14,51.44 14.61,48.89 14.61,44.45 15.24,43.81 19.05,43.5 22.22,40.32 25.4,40.32 26.04,39.69 26.04,39.37 25.08,38.42 20.64,38.42 20.32,38.73 20.32,39.05 19.05,40.32 15.56,40.32 12.7,37.47 12.7,32.07 14.29,30.48 13.34,29.53 13.34,26.04 9.53,26.04 7.62,24.13 7.62,21.59 8.89,20.32 12.7,20.32 19.68,13.34 19.68,10.16 16.51,10.16 15.88,10.8 15.88,13.34 14.61,14.61 9.53,14.61 7.62,12.7 7.62,12.07 9.53,10.16 10.79,10.16 15.24,5.71 26.04,5.71 28.57,8.26 29.21,8.26 29.21,2.86 4.76,2.86
  pour Top: 41.28,36.83 74.3,36.83 74.3,47.62 63.18,47.62 61.59,42.86 54.29,40 54.61,50.8 50.16,50.8 49.53,50.17 41.28,50.17
  pour Top: 51.75,2.86 51.44,19.05 73.03,19.05 73.03,19.68 73.66,20.32 74.93,19.05 105.41,19.05 105.09,3.49 104.46,2.86
  pour Top: 28.57,2.86 28.57,13.34 27.3,14.61 24.76,14.61 24.76,16.51 23.49,17.78 24.76,19.05 26.67,17.14 30.48,17.14 31.75,18.41 33.66,18.41 38.1,22.86 38.1,31.11 40.64,33.66 40.64,34.92 41.91,36.19 74.93,36.19 74.93,45.72 78.11,45.72 78.11,47.62 78.74,48.26 105.09,48.26 105.09,16.51 79.38,16.51 79.38,24.77 78.11,26.04 78.11,28.26 76.84,29.53 76.2,29.53 74.93,28.26 74.93,24.77 73.66,23.5 73.66,16.51 58.42,16.51 58.42,24.77 57.15,26.04 57.15,27.94 56.52,28.57 54.61,28.57 54.61,26.67 52.71,24.77 52.71,2.86
LED
  Top 0.305: U1.D13 32.77,60.07 31.75,59.05 29.84,59.05 29.21,58.42 29.21,57.42 R12.2
MISO  (via drill 0.6)  (1 unrouted)
  Top 0.305: U$3.3 96.84,10.8 92.41,10.8 91.14,9.53 86.36,9.53 85.09,10.8 v83.82,10.8 | v69.85,43.81 v73.66,41.28
  Bottom 0.305: U1.D50 99.06,20.96 99.06,19.21 98.27,18.41 97.16,18.41 96.52,17.78 96.52,9.53 97.47,8.57 99.06,8.57 U$3.3 | 69.85,9.53 82.55,9.53 v83.82,10.8 | U$8.RST 86.36,13.34 86.23,13.2 84.62,13.2 83.82,12.4 v83.82,10.8 | 83.95,10.93 v83.82,10.8 | 69.85,9.53 69.85,10.8 69.72,10.93 69.38,10.93 68.72,11.59 68.72,12.27 67.78,13.2 67.44,13.2 U$7.RST | U$6.RST 47.12,13.2 47.46,13.2 48.4,12.27 48.4,11.59 50.47,9.53 69.85,9.53 | U$4.RST 50.8,43.81 v69.85,43.81 | v73.66,41.28 73.07,41.28 70.35,38.55 68.13,38.55 67.05,37.47 U$5.RST
MOSI  (via drill 0.6)
  Top 0.305: U$3.4 99.38,5.71 93.98,5.71 92.71,6.98 83.82,6.98 81.28,9.53 78.74,9.53 | 78.74,9.53 U$8.MS1 | 58.42,9.53 U$7.MS1 58.42,16.63 58.27,16.78 58.27,25.15 57.34,26.08 57.34,27.75 58.42,28.84 v58.42,34.92 | 78.74,9.53 67.98,9.53 65.91,11.59 65.91,12.54 64.58,13.86 64.58,15.05 63.95,15.69 63.05,15.69 62.41,15.05 62.41,13.86 61.09,12.54 61.09,10.93 58.42,9.53 | U$6.MS1 38.1,10.8 39.37,9.53 58.42,9.53
  Bottom 0.305: U$3.4 101.75,5.87 103.82,5.87 104.23,6.27 104.23,8.17 103.82,8.57 103.82,13.34 101.52,15.63 101.52,21.03 U1.D51 | U$4.MS1 38.47,37.47 39.56,36.38 56.33,36.38 57.41,37.47 U$5.MS1 v58.42,34.92
N$1
  Top 0.305: LED3.C 6.35,56.52 6.98,55.88 13.97,55.88 14.61,55.25 14.61,44.45 15.24,43.81 U$2.P$4
  Bottom 1.27: Q2.D 27.3,45.4 25.72,43.81 U$2.P$4
N$3
  Bottom 1.422: U$4.2B E0-MOT.1
N$4
  Bottom 1.422: U$4.2A E0-MOT.2
N$7
  Top 0.305: LED4.C 8.89,57.78 10.16,56.52 15.88,56.52 16.51,55.88 16.51,54.61 U$2.P$6
  Bottom 1.27: 27.46,54.77 Q1.D 27.15,55.4 25.88,56.67 23.97,56.67 22.38,55.09 18.26,55.09 U$2.P$6
N$8
  Top 0.305: R29.2 79.46,5.71 78.43,6.75 60.72,6.75 Q4.D 57.04,3.18 55.08,5.13 54.14,5.13 53.45,4.45 X1.1
N$9
  Top 0.305: R10.2 10.16,0.63 64.77,0.63 Q5.G
N$10
  Bottom 1.422: U$4.1A E0-MOT.3
N$11
  Bottom 1.422: U$4.1B E0-MOT.4
N$12
  Bottom 1.422: U$5.2B E1-MOT.1
N$13
  Bottom 1.422: U$5.2A E1-MOT.2
N$14
  Top 0.305: Q4.G 49.75,3.18 48.71,2.13 10.48,2.13 2.66,9.96 2.66,17.98 3.39,18.71 R8.2
N$16
  Bottom 1.422: U$5.1A E1-MOT.3
N$18
  Bottom 1.422: U$5.1B E1-MOT.4
N$20
  Top 0.305: R28.2 79.46,3.18 78.43,2.15 74.58,2.15 71.59,5.13 70.65,5.13 68.69,3.18 Q5.D
  Bottom 0.305: Q5.D 68.47,3.18 66.51,1.22 54.14,1.22 53.45,1.91 40.64,1.91 X1.3
N$21
  Bottom 1.422: U$6.2B X-MOT.1
N$22
  Bottom 1.422: U$6.2A X-MOT.2
N$26
  Bottom 1.422: U$6.1A X-MOT.3
N$27
  Bottom 1.422: U$6.1B X-MOT.4
N$28
  Bottom 1.422: U$7.2B Y-MOT.1
N$29
  Bottom 1.422: U$7.2A Y-MOT.2
N$30
  Bottom 1.422: U$7.1A Y-MOT.3
N$32
  Top 0.305: R23.2 30.21,36.46 LED2.A
N$36
  Bottom 1.422: U$7.1B Y-MOT.4
N$41
  Bottom 1.422: U$8.2B Z-MOT1.1 Z-MOT.1
N$42
  Bottom 1.422: U$8.2A Z-MOT1.2 Z-MOT.2
N$43
  Bottom 1.422: U$8.1A Z-MOT1.3 Z-MOT.3
N$44
  Bottom 1.422: U$8.1B Z-MOT1.4 Z-MOT.4
N$45
  Top 0.305: R24.2 13.97,60.96 13.34,61.59 6.98,61.59 6.35,60.96 LED3.A
N$46
  Top 0.305: R12.1 26.04,57.15 25.4,57.78 24.51,57.78 LED1.A
N$47
  Top 0.305: R14.2 33.66,52.7 29.84,48.89 Q2.G | Q2.G
N$48
  Top 0.305: R13.2 31.54,56.3 29.84,54.61 29.84,53.82 Q1.G
N$49  (via drill 0.6)
  Top 0.305: R15.2 34.71,41.49 v34.29,41.91
  Bottom 0.305: v34.29,41.91 34.29,39.37 28.89,33.97 Q3.G
N$50
  Top 0.305: R25.2 8.94,60.05 LED4.A
N$51
  Top 0.305: LED2.C 25.72,36.51 25.4,36.19 25.08,36.19 Q3.D
  Top 1.27: U$2.P$2 19.05,33.66 21.91,36.51 Q3.D
  Bottom 1.27: U$2.P$2 19.05,33.66 21.91,36.51 Q3.D
  pour Top: 15.24,35.24 15.24,33.34 15.88,32.7 20,32.7 22.54,35.24 24.76,35.24 25.4,35.88 25.4,37.15 24.76,37.78 20.64,37.78 19.05,36.19 16.19,36.19
  pour Bottom: 14.92,35.56 14.92,32.39 15.88,31.43 19.05,31.43 22.86,35.24 26.35,35.24 26.99,35.88 26.99,37.15 26.35,37.78 20.64,37.78 19.05,36.19 15.56,36.19
N$53
  Top 1.27: X4.1 11.27,22.86 13.34,22.86 22.7,13.49 F2.1
  Bottom 1.422: 13.34,22.86 11.43,22.86 | 13.34,22.86 22.86,13.34 22.86,11.43 | 13.34,22.86 13.18,22.7 X4.1
  pour Bottom: 8.26,24.13 8.26,21.59 8.89,20.96 12.7,20.96 20.32,13.34 20.32,10.8 20.95,10.16 23.49,10.16 24.13,10.8 24.13,15.88 22.22,17.78 21.59,17.78 13.97,25.4 9.53,25.4
  pour Top: 8.26,24.13 8.26,21.59 8.89,20.96 12.7,20.96 20.32,13.34 20.32,10.8 20.95,10.16 23.49,10.16 24.13,10.8 24.13,15.88 22.22,17.78 21.59,17.78 13.97,25.4 9.53,25.4
N$54
  Top 1.27: X4.3 12.22,12.54 18.41,6.98 24.13,6.98 26.04,8.26 26.04,10.64 F1.2
  Bottom 1.422: 11.43,12.7 12.07,12.7 17.14,6.98 24.13,6.98 26.04,8.26 26.04,10.8
  pour Bottom: 8.26,12.7 8.26,12.07 9.53,10.8 10.79,10.8 15.24,6.35 26.04,6.35 27.94,8.26 27.94,13.34 27.3,13.97 25.4,13.97 24.76,13.34 24.76,9.53 23.49,8.26 21.59,8.26 20.32,9.53 16.51,9.53 15.24,10.8 15.24,13.34 14.61,13.97 9.53,13.97
  pour Top: 8.26,12.7 8.26,12.07 9.53,10.8 10.79,10.8 15.24,6.35 26.04,6.35 27.94,8.26 27.94,13.34 27.3,13.97 25.4,13.97 24.76,13.34 24.76,9.53 23.49,8.26 21.59,8.26 20.32,9.53 16.51,9.53 15.24,10.8 15.24,13.34 14.61,13.97 9.53,13.97
SCK  (via drill 0.6)
  Top 0.305: U$3.5 97.63,7.14 96.52,8.26 84.75,8.26 81.28,11.73 U$8.MS2 | U$4.MS2 40.01,34.77 42.09,32.68 42.09,26.86 43.18,25.77 v43.18,23.5
  Bottom 0.305: U1.D52 97.63,19.53 97.16,19.53 95.41,17.78 95.41,13.97 93.98,12.86 93.98,10.48 97.31,7.14 U$3.5 | U$8.MS2 80.27,14.61 79.19,15.69 63.05,15.69 61.97,14.61 U$7.MS2 59.95,14.61 56.09,18.47 45.51,18.47 41.65,14.61 U$6.MS2 39.17,16.07 36.65,16.07 36.65,14.16 36.01,13.52 35.11,13.52 34.48,14.16 34.48,15.47 41.71,22.71 43.18,22.71 | 43.18,22.71 77.41,22.71 79.83,25.12 79.83,28.6 72.72,35.71 62.71,35.71 U$5.MS2 | v43.18,23.5 43.18,22.71
SCL
  Top 0.305: R22.1 96.52,41.55 96.52,55.25 93.5,58.26 I2C.4
  Bottom 0.305: I2C.4 91.28,60.33 U1.D21
SDA
  Top 0.305: R21.1 95.25,47.62 94.62,48.26 94.62,53.97 93.34,55.25 I2C.3
  Bottom 0.305: I2C.3 90.33,58.74 89.53,58.74 87.95,60.33 U1.D20
THERM0
  Top 0.305: U1.A13 91.44,13.34 92.23,13.34 92.71,13.81 92.71,15.88 95.25,18.41 95.25,33.66 93.5,35.4 84.61,35.4 83.82,36.19 JP7.2 83.82,45.08 82.55,46.36 80.82,46.36 C5.+ 80.06,46.4 79.38,45.72 79.38,42.29 R7.1
THERM1
  Top 0.305: U1.A14 93.98,13.34 95.25,13.34 95.89,13.97 95.89,34.29 93.98,36.19 89.38,36.19 88.9,36.67 JP7.4 88.9,45.08 87.63,46.36 85.9,46.36 C8.+ 85.85,48.13 85.73,48.26 79.38,48.26 78.74,47.62 78.74,43.18 78.11,42.55 77.41,42.55 R1.1
THERM2
  Top 0.305: U1.A15 96.52,13.34 96.52,34.92 JP7.6 | JP7.6 93.82,37.62 | R11.1 78.11,46.15 78.11,48.26 78.74,48.89 90.17,48.89 90.93,48.13 C1.+ 90.98,46.36 92.71,46.36 93.98,45.08 JP7.6
VCC  (via drill 0.6)
  Top 0.305: R18.1 39.37,16.88 39.37,13.97 41.28,12.07 U1.5V@0 41.91,10.8 45.72,10.8 45.72,13.07 46.8,14.16 46.8,15.05 45.72,16.14 45.72,22.23 U$6.VDD | R22.2 R21.2 93.34,47.26 I2C.1 | 75.2,40 75.2,39.1 77.15,37.15 v77.15,34.61 71.12,28.57 U$7.VDD 71.12,23.13 68.13,20.14 | 75.2,40 R7.2 R1.2 R11.2 75.2,47.74 X-.3 | R16.1 51.8,42.59 52.07,42.86 52.07,45.08 50.8,46.36 50.8,47.62 50.16,48.26 U$4.VDD | R19.1 68.13,20.14 | R20.1 76.75,20.14 68.13,20.14 | 75.2,40 R17.1 60.69,38.78 59.51,37.6 59.51,37.02 58.87,36.38 58.29,36.38 55.25,33.34 | U$9.1 104.14,18.41 104.14,61.59 76.2,61.59 76.2,51.75
  Top 0.406: 51.44,41.28 51.44,41 R16.1 50.21,39.05 49.53,39.05 48.9,38.42 48.9,36.51 49.85,35.56 53.02,35.56 55.25,33.34 55.25,31.75 53.34,29.85 52.39,29.85 50.8,28.26 U$6.VDD | U$6.VDD | U$5.VDD 72.71,51.75 76.2,51.75 76.99,51.75 X-.3 Y-.3 Z-.3 | I2C.1 Z-.3 | Z-.3
  Bottom 0.305: X-.3 78.11,50.32 | U$8.VDD 91.44,28.57 93.34,30.48 93.34,32.7 91.76,34.29 78.42,34.29 78.11,34.61 v77.15,34.61 | I2C.1
  Bottom 0.406: U1.5V@2 U1.5V@1 95.25,57.78 95.25,52.7 93.34,50.8
  Bottom 0.61: I2C.1 93.34,50.8
X-DIR
  Bottom 0.305: U$6.DIR U1.A1
X-EN
  Top 0.305: R18.2 35.56,15.61 U$6.EN
  Bottom 0.305: U1.D38 97.79,36.83 96.52,35.56 96.52,34.92 | 96.52,34.92 96.52,34.61 | 96.52,34.92 94.46,32.86 94.46,30.32 92.71,28.57 92.71,22.86 92.08,22.23 41.91,22.23 35.56,15.88 U$6.EN | U$6.EN
X-MIN
  Bottom 0.305: X-.1 78.11,56.67 77.79,56.99 73.82,56.99 72.55,58.26 61.75,58.26 U1.D3
X-STEP
  Bottom 0.305: U$6.STEP U1.A0
Y-DIR
  Bottom 0.305: U1.A7
  Bottom 0.406: U1.A7 72.39,13.34 U$7.DIR
Y-EN
  Top 0.305: U1.A2 59.69,15.24 62.23,17.78 R19.2
  Bottom 0.305: U$7.EN U1.A2
Y-MIN
  Bottom 0.305: Y-.1 83.19,56.2 81.12,58.26 74.45,58.26 U1.D14
Y-STEP
  Bottom 0.305: U1.A6
  Bottom 0.406: U1.A6 69.85,13.34 U$7.STEP
Z-DIR
  Bottom 0.305: U$8.DIR 93.98,17.46 96.52,20 96.52,23.5 U1.D48
Z-EN
  Top 0.305: U1.A8 76.2,13.34 U$8.EN 77.74,16.14 R20.2
Z-MIN
  Bottom 0.305: Z-.1 88.27,56.2 85.57,58.9 83.98,58.9 U1.D18
Z-STEP
  Bottom 0.305: U$8.STEP 91.44,16.19 95.89,20.64 95.89,24.13 96.52,24.77 96.52,25.4 97.63,26.51 97.63,27.15 U1.D46
(copper drawn outside any net)
  shapes: Bottom circle x1

### Text on the board
tNames: 2B | 2A | 1A | 1B | 2B | 2A | 1A | 1B | 9 | 10 | MS1 | MS2 | MS3 | MS1 | MS3 | 8 | 2B | 2A | 1A | 1B | 2B | 2A | 1A | 1B | 2B | 2A | 1A | 1B | MS2 | MS1 | MS3 | MS2 | MS1 | MS3 | MS2 | MS1 | MS3 | 11A+ | 5A | GND | 8 | 1 | 1
bNames: + | + | + | +
Document: RAMPS 1.4 (RepRap Arduino MEGA Pololu Shield) | GPL v3 | reprap.org/wiki/RAMPS1.4 | Reversing input power, and inserting stepper drivers incorrectly will destroy electronics. | I2C | 21 | 20 | 12-35V Out | GND | 5V | - | D10 | + | AUX-4 | D16 | - | D17 | D9 | + | D23 | D25 | - | D11 | D27 | + | D29 | D31 | 12-35VDC In | D33 | + | D35 | 11A | D37 | - | D38 | D41 | + | 5A | D43 | - | D45 | AUX-1 | D47 | D32 | GND | 5V
_tsilk: + | I2C | END STOPS | 21 | + | E0 | 1 | S | 20 | D10 | 1 | - | - | E1 | + | + | + | D9 | T0 | T1 | T2 | + | 1 | + | D8 | 1 | 1 | 1 | U | X | Y | Z | + | + | - | 1 | + | PS | AUX-4 | AUX-3 | s | 1 | - | + | UltiMachine | GPL3 | 1 | SERVOS | 1 | reprap.org/wiki/RAMPS | V1.4 | -